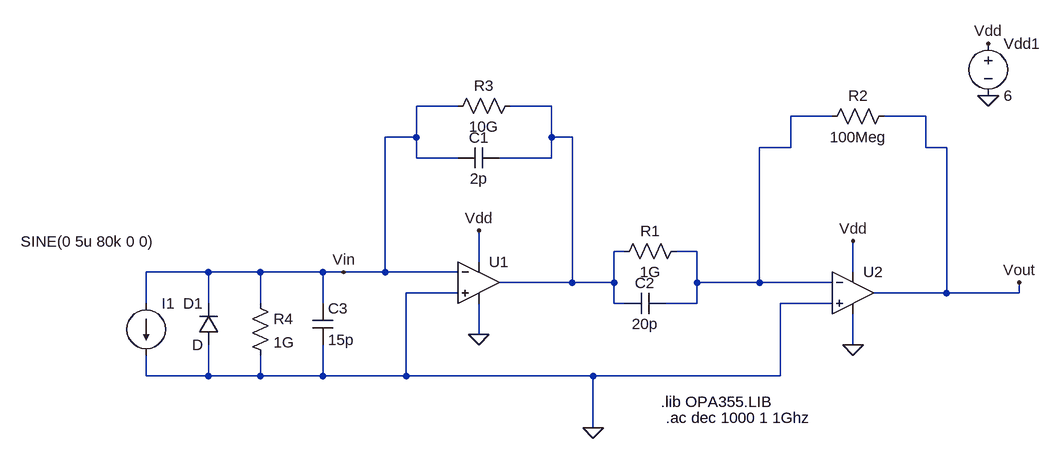
[diagram p0: schematic Draft7.asc]
Draft7.asc, the LTspice schematic file:
Version 4
SHEET 1 1332 680
WIRE 416 16 352 16
WIRE 560 16 496 16
WIRE 992 32 928 32
WIRE 1136 32 1072 32
WIRE 352 64 352 16
WIRE 352 64 304 64
WIRE 560 64 560 16
WIRE 592 64 560 64
WIRE 928 80 928 32
WIRE 928 80 880 80
WIRE 1136 80 1136 32
WIRE 1168 80 1136 80
WIRE 352 96 352 64
WIRE 416 96 352 96
WIRE 560 96 560 64
WIRE 560 96 480 96
WIRE 672 240 656 240
WIRE 784 240 752 240
WIRE 448 256 448 208
WIRE 32 272 -64 272
WIRE 112 272 32 272
WIRE 208 272 112 272
WIRE 240 272 208 272
WIRE 304 272 304 64
WIRE 304 272 240 272
WIRE 416 272 304 272
WIRE 1024 272 1024 224
WIRE 592 288 592 64
WIRE 592 288 480 288
WIRE 656 288 656 240
WIRE 656 288 592 288
WIRE 784 288 784 240
WIRE 880 288 880 80
WIRE 880 288 784 288
WIRE 992 288 880 288
WIRE 416 304 336 304
WIRE 1168 304 1168 80
WIRE 1168 304 1056 304
WIRE 1280 304 1280 288
WIRE 1280 304 1168 304
WIRE -64 320 -64 272
WIRE 32 320 32 272
WIRE 112 320 112 272
WIRE 208 320 208 272
WIRE 656 320 656 288
WIRE 672 320 656 320
WIRE 784 320 784 288
WIRE 784 320 736 320
WIRE 992 320 912 320
WIRE 448 368 448 320
WIRE 1024 384 1024 336
WIRE -64 432 -64 400
WIRE 32 432 32 384
WIRE 32 432 -64 432
WIRE 112 432 112 400
WIRE 112 432 32 432
WIRE 208 432 208 384
WIRE 208 432 112 432
WIRE 336 432 336 304
WIRE 336 432 208 432
WIRE 624 432 336 432
WIRE 912 432 912 320
WIRE 912 432 624 432
WIRE 624 512 624 432
FLAG 448 208 Vdd
FLAG 624 512 0
FLAG 1232 0 0
FLAG 1280 288 Vout
FLAG 1232 -80 Vdd
FLAG 1024 224 Vdd
FLAG 240 272 Vin
FLAG 448 368 0
FLAG 1024 384 0
SYMBOL res 512 0 R90
WINDOW 0 0 56 VBottom 2
WINDOW 3 32 56 VTop 2
SYMATTR InstName R3
SYMATTR Value 10G
SYMBOL voltage 1232 -96 R0
SYMATTR InstName Vdd1
SYMATTR Value 6
SYMBOL res 96 304 R0
SYMATTR InstName R4
SYMATTR Value 1G
SYMBOL cap 192 320 R0
SYMATTR InstName C3
SYMATTR Value 15p
SYMBOL current -64 320 R0
WINDOW 3 -193 -95 Left 2
SYMATTR Value SINE(0 5u 80k 0 0)
SYMATTR InstName I1
SYMATTR Value2 AC 5u 0
SYMBOL diode 48 384 R180
WINDOW 0 24 64 Left 2
WINDOW 3 24 0 Left 2
SYMATTR InstName D1
SYMBOL cap 480 80 R90
WINDOW 0 0 32 VBottom 2
WINDOW 3 32 32 VTop 2
SYMATTR InstName C1
SYMATTR Value 2p
SYMBOL res 768 224 R90
WINDOW 0 0 56 VBottom 2
WINDOW 3 32 56 VTop 2
SYMATTR InstName R1
SYMATTR Value 1G
SYMBOL cap 736 304 R90
WINDOW 0 0 32 VBottom 2
WINDOW 3 32 32 VTop 2
SYMATTR InstName C2
SYMATTR Value 20p
SYMBOL res 1088 16 R90
WINDOW 0 0 56 VBottom 2
WINDOW 3 32 56 VTop 2
SYMATTR InstName R2
SYMATTR Value 100Meg
SYMBOL OpAmps/UniversalOpAmp 448 288 R0
SYMATTR InstName U1
SYMBOL OpAmps/UniversalOpAmp 1024 304 R0
SYMATTR InstName U2
TEXT 728 472 Left 2 !.lib OPA355.LIB
TEXT 736 496 Left 2 !.ac dec 1000 1 1Ghz

The netlist it stands for:
* Draft7.asc
R3 N001 Vin 10G
Vdd1 Vdd 0 6
R4 Vin 0 1G
C3 Vin 0 15p
I1 Vin 0 SINE(0 5u 80k 0 0) AC 5u 0
D1 0 Vin D
C1 N001 Vin 2p
R1 N002 N001 1G
C2 N002 N001 20p
R2 Vout N002 100Meg
XU1 0 Vin Vdd 0 N001 level1 Avol=1Meg GBW=10Meg Vos=0 En=0 Enk=0 In=0 Ink=0 Rin=500Meg  ; pins In+ In- V+ V- OUT
XU2 0 N002 Vdd 0 Vout level1 Avol=1Meg GBW=10Meg Vos=0 En=0 Enk=0 In=0 Ink=0 Rin=500Meg  ; pins In+ In- V+ V- OUT
.model D D
.lib standard.dio
.lib OPA355.LIB
.ac dec 1000 1 1Ghz
.lib UniversalOpAmp1.lib
.backanno
.end